# Altium project AngleMod V1.PrjPcb
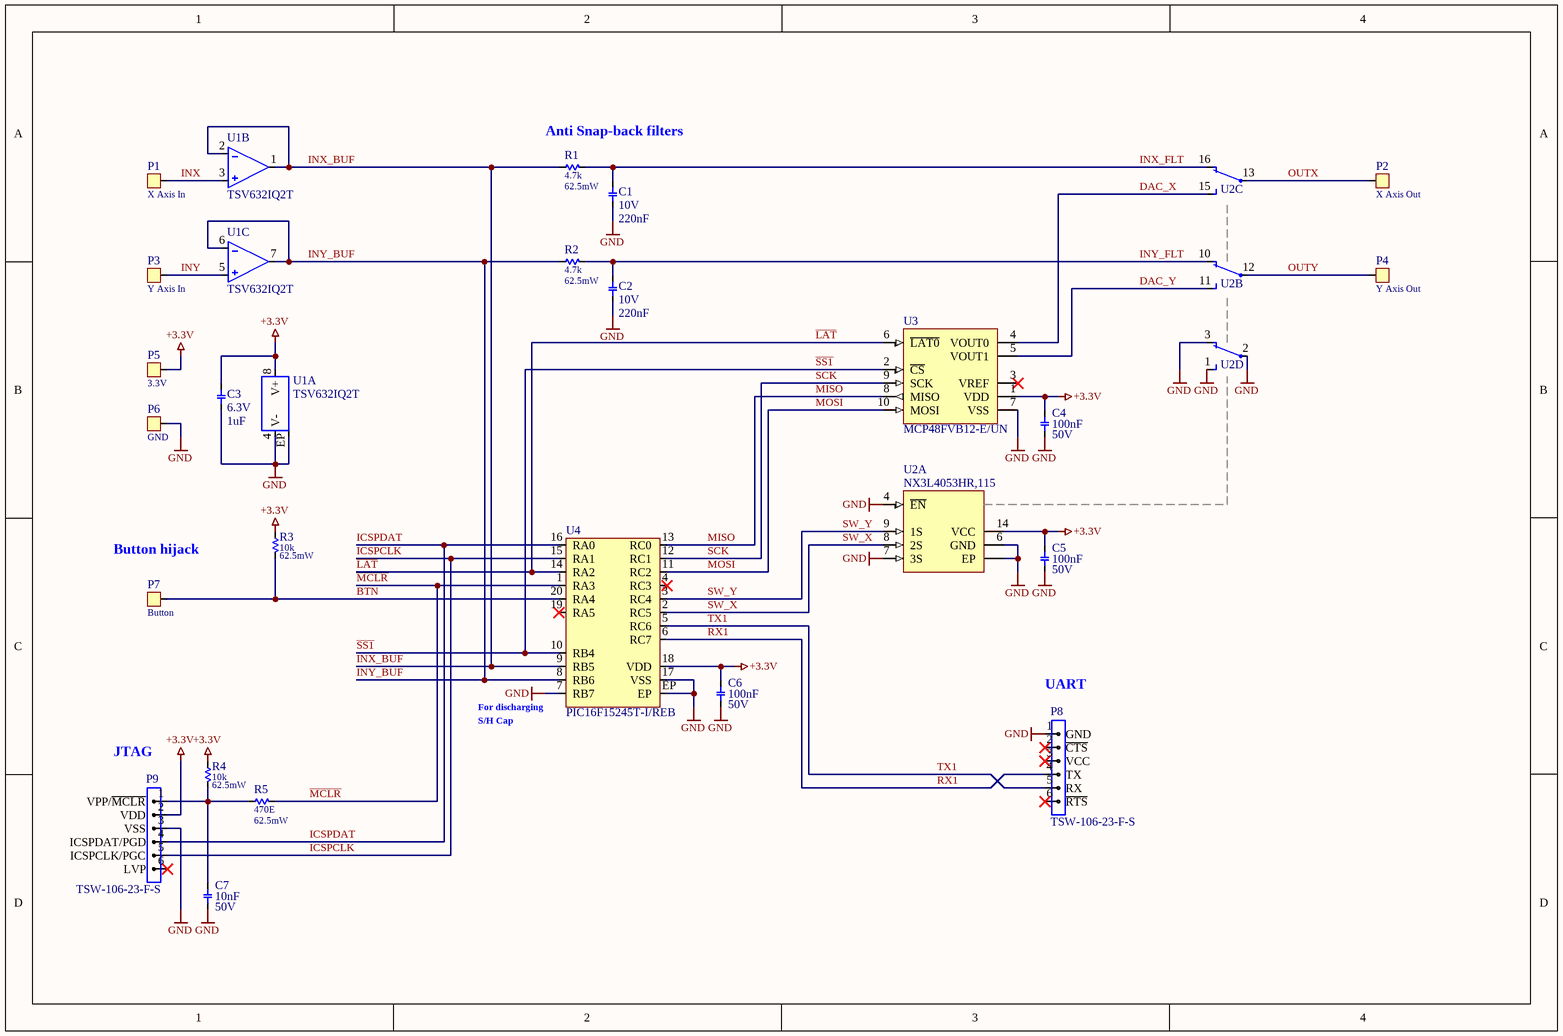
[diagram p0: AngleMod V1.SchDoc]
Author: TheComet; BoardRevision: V1; ProjectTitle: AngleMod
1 sheet, 25 parts. Net scope: global (net labels, ports and power ports of the same name join across sheets).
Board file: AngleMod V1.PcbDoc

## Sheet AngleMod V1.SchDoc: =ProjectTitle
size A4; DrawnBy: TheComet; Engineer: TheComet; Revision: V1; SheetNumber: 1; SheetTotal: 1

### Parts
C1  value 220nF  Value2: 10V  [CX7R0603K]  (hidden comment: CC0603KRX7R6BB224)
C2  value 220nF  Value2: 10V  [CX7R0603K]  (hidden comment: CC0603KRX7R6BB224)
C3  value 1uF  Value2: 6.3V  [CX7R0603K]  (hidden comment: 06036C105JAT2A)
C4  value 100nF  Value2: 50V  [CX7R0402C]  (hidden comment: 04025C104JAT2A)
C5  value 100nF  Value2: 50V  [CX7R0402C]  (hidden comment: 04025C104JAT2A)
C6  value 100nF  Value2: 50V  [CX7R0402C]  (hidden comment: 04025C104JAT2A)
C7  value 10nF  Value2: 50V  [CX7R0402C]  (hidden comment: 04025C104JAT2A)
P1  Name: X Axis In  [PAD_2X1.5_SQUARE]  (hidden comment: SMD Pad 1 pin)
P2  Name: X Axis Out  [PAD_2X1.5_SQUARE]  (hidden comment: SMD Pad 1 pin)
P3  Name: Y Axis In  [PAD_2X1.5_SQUARE]  (hidden comment: SMD Pad 1 pin)
P4  Name: Y Axis Out  [PAD_2X1.5_SQUARE]  (hidden comment: SMD Pad 1 pin)
P5  Name: 3.3V  [PAD_2X1.5_SQUARE]  (hidden comment: SMD Pad 1 pin)
P6  Name: GND  [PAD_2X1.5_SQUARE]  (hidden comment: SMD Pad 1 pin)
P7  Name: Button  [PAD_2X1.5_SQUARE]  (hidden comment: SMD Pad 1 pin)
P8  TSW-106-23-F-S  [TSW-106-23-F-S_SIDEA]
P9  TSW-106-23-F-S  [TSW-106-23-F-S_SIDEA]
R1  value 4.7k  Value2: 62.5mW  [RT0402_C]  (hidden comment: RG1005P-472-B-T5)
R2  value 4.7k  Value2: 62.5mW  [RT0402_C]  (hidden comment: RG1005P-472-B-T5)
R3  value 10k  Value2: 62.5mW  [RT0402_C]  (hidden comment: TBD)
R4  value 10k  Value2: 62.5mW  [RT0402_C]  (hidden comment: TBD)
R5  value 470E  Value2: 62.5mW  [RT0402_C]  (hidden comment: TBD)
U1  TSV632IQ2T  [DFN-8_2X2_0.5_C]  (parts A,B,C of 3)
U2  NX3L4053HR,115  [HXQFN-16_SOT-1039-2_C]  (parts A,B,C,D of 4)
U3  MCP48FVB12-E/UN  [MSOP-10_0.5_C]
U4  PIC16F15245T-I/REB  [VQFN-20_0.4_C]

### Nets
+3.3V: C3.2 C4.2 C5.2 C6.2 P5.1 P9.2(VDD) R3.2 R4.2 U1.8(V+) U2.14(VCC) U3.1(VDD) U4.18(VDD)
GND: C1.1 C2.1 C3.1 C4.1 C5.1 C6.1 C7.1 P6.1 P8.1(GND) P9.3(VSS) U1.4(V-) U1.EP U2.1(3Y1) U2.2(3Z) U2.3(3Y0) U2.4(~{EN}) U2.6(GND) U2.7(3S) U2.EP U3.7(VSS) U4.7(RB7) U4.17(VSS) U4.EP
BTN: P7.1 R3.1 U4.20(RA4)
DAC_X: U2.15(2Y1) U3.4(VOUT0)
DAC_Y: U2.11(1Y1) U3.5(VOUT1)
ICSPCLK: P9.5(ICSPCLK/PGC) U4.15(RA1)
ICSPDAT: P9.4(ICSPDAT/PGD) U4.16(RA0)
INX: P1.1 U1.3(IN1+)
INX_BUF: R1.2 U1.1(OUT1) U1.2(IN1-) U4.9(RB5)
INX_FLT: C1.2 R1.1 U2.16(2Y0)
INY: P3.1 U1.5(IN2+)
INY_BUF: R2.2 U1.6(IN2-) U1.7(OUT2) U4.8(RB6)
INY_FLT: C2.2 R2.1 U2.10(1Y0)
~{LAT}: U3.6(~{LAT0}) U4.14(RA2)
~{MCLR}: R5.1 U4.1(RA3)
MISO: U3.8(MISO) U4.13(RC0)
MOSI: U3.10(MOSI) U4.11(RC2)
OUTX: P2.1 U2.13(2Z)
OUTY: P4.1 U2.12(1Z)
RX1: P8.4(TX) U4.6(RC7)
~{SS1}: U3.2(~{CS}) U4.10(RB4)
SCK: U3.9(SCK) U4.12(RC1)
SW_X: U2.8(2S) U4.2(RC5)
SW_Y: U2.9(1S) U4.3(RC4)
TX1: P8.5(RX) U4.5(RC6)
NetC7_2: C7.2 P9.1(VPP/~{MCLR}) R4.1 R5.2

Not connected (* = marked no-connect by the designer): P8 2(~{CTS})* 3(VCC)* 6(~{RTS})*; P9 6(LVP)*; U3 3(VREF)*; U4 4(RC3)* 19(RA5)*

### Notes on the sheet
- (near R1) Anti Snap-back filters
- (near P7) Button hijack
- (near U4) For discharging
- (near P8) UART
- JTAG
- S/H Cap

### Library data of the parts
C1 C2 = kyocera-C-X7R-0603: 0.22 µF ±10% 10V Ceramic Capacitor X7R 0603 (1608 Metric); Size: 0603; Type: CC0603KRX7R6BB224
C3 = kyocera-C-X7R-0603: SMD Capacitor; Dielectric: C; ToleranceCode: J; MaxThicknessCode: K; VoltageCode: 6; CapacitanceCode: 105; Size: 0603
C4-C7 = kyocera-C-X7R-0402: SMD Capacitor; CapacitanceCode: 104; VoltageCode: 5; Dielectric: C; ToleranceCode: J; MaxThicknessCode: E; Size: 0402
P1-P7 = SMD Pad 1 pin: Single SMD Pad
P8 P9 = TSW-106-23-F-S: Connector Header Through Hole 6 position 0.100" (2.54mm); Manufacturer 1: Samtec Inc.; Type: TSW-106-23-F-S; Manufacturer Part Number 1: TSW-106-23-F-S
R1-R5 = RT0402DRD0747KL: 4.7 kOhms ±0.1% 0.063W, 1/16W Chip Resistor 0402 (1005 Metric) Anti-Sulfur, Automotive AEC-Q200 Thin Film
  R1 R2: Type: RG1005P-472-B-T5
  R3-R5: Type: TBD
U1 = TSV632IQ2T: General Purpose Amplifier 2 Circuit Rail-to-Rail 8-DFN (2x2); Manufacturer 1: STMicroelectronics; Manufacturer Part Number 1: TSV632IQ2T; Type: TSV632IQ2T
U2 = NX3L4053: 3 Circuit IC Switch 2:1 800mOhm 16-HXQFN (3x3); Manufacturer Part Number 1: NXP USA Inc.; Type: NX3L4053HR,115; Manufacturer 1: NX3L4053HR,115
U3 = MCP48FVB12-E/UN: Manufacturer 1: Microchip Technology; Manufacturer Part Number 1: MCP48FVB12-E/UN; Type: MCP48FVB12-E/UN
U4 = PIC16F15245T-I/REB: Manufacturer 1: Microchip Technology; Manufacturer Part Number 1: PIC16F15245T-I/REB; Type: PIC16F15245T-I/REB